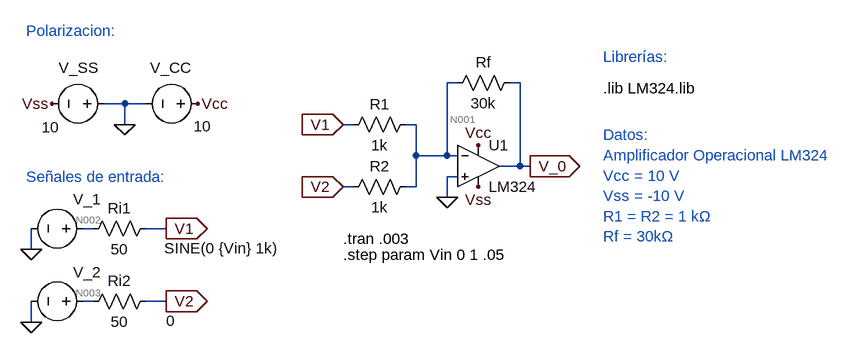
[diagram p0: schematic Lab_2_Circ_1_saturacion.asc]
Lab_2_Circ_1_saturacion.asc, the LTspice schematic file:
Version 4
SHEET 1 1560 680
WIRE 544 -288 528 -288
WIRE 640 -288 624 -288
WIRE 32 -256 0 -256
WIRE 64 -256 32 -256
WIRE 32 -224 32 -256
WIRE 384 -224 368 -224
WIRE 480 -224 464 -224
WIRE 480 -176 480 -224
WIRE 528 -176 528 -288
WIRE 528 -176 480 -176
WIRE 544 -176 528 -176
WIRE 640 -160 640 -288
WIRE 640 -160 608 -160
WIRE 656 -160 640 -160
WIRE 544 -144 528 -144
WIRE 384 -128 368 -128
WIRE 480 -128 480 -176
WIRE 480 -128 464 -128
WIRE 528 -112 528 -144
WIRE -16 -64 -32 -64
WIRE 96 -64 64 -64
WIRE -112 -32 -112 -64
WIRE -16 48 -32 48
WIRE 96 48 64 48
WIRE -112 80 -112 48
FLAG 528 -112 0
FLAG 144 -256 Vcc
FLAG 576 -192 Vcc
FLAG -80 -256 Vss
FLAG 576 -128 Vss
FLAG 32 -224 0
FLAG -112 -32 0
FLAG 368 -224 V1
IOPIN 368 -224 In
FLAG 96 -64 V1
IOPIN 96 -64 Out
FLAG 368 -128 V2
IOPIN 368 -128 In
FLAG 656 -160 V_0
IOPIN 656 -160 Out
FLAG -112 80 0
FLAG 96 48 V2
IOPIN 96 48 Out
SYMBOL OpAmps\\opamp2 576 -224 R0
SYMATTR InstName U1
SYMATTR Value LM324
SYMBOL res 368 -208 R270
WINDOW 0 32 56 VTop 2
WINDOW 3 0 56 VBottom 2
SYMATTR InstName R1
SYMATTR Value 1k
SYMBOL res 368 -112 R270
WINDOW 0 32 56 VTop 2
WINDOW 3 0 56 VBottom 2
SYMATTR InstName R2
SYMATTR Value 1k
SYMBOL res 640 -304 R90
WINDOW 0 0 56 VBottom 2
WINDOW 3 32 56 VTop 2
SYMATTR InstName Rf
SYMATTR Value 30k
SYMBOL res -32 -48 R270
WINDOW 0 32 56 VTop 2
WINDOW 3 0 56 VBottom 2
SYMATTR InstName Ri1
SYMATTR Value 50
SYMBOL voltage -16 -64 M270
WINDOW 0 45 31 VLeft 2
WINDOW 3 -30 -109 VLeft 2
WINDOW 123 -27 -57 VLeft 2
WINDOW 39 0 0 Left 0
SYMATTR InstName V_1
SYMATTR Value SINE(0 {Vin} 1k)
SYMBOL voltage 160 -256 R90
WINDOW 0 -55 25 VRight 2
WINDOW 3 35 -5 VRight 2
WINDOW 123 0 0 Left 0
WINDOW 39 0 0 Left 0
SYMATTR InstName V_CC
SYMATTR Value 10
SYMBOL voltage 16 -256 R90
WINDOW 0 -55 25 VRight 2
WINDOW 3 36 85 VRight 2
WINDOW 123 0 0 Left 0
WINDOW 39 0 0 Left 0
SYMATTR InstName V_SS
SYMATTR Value 10
SYMBOL res -32 64 R270
WINDOW 0 32 56 VTop 2
WINDOW 3 0 56 VBottom 2
SYMATTR InstName Ri2
SYMATTR Value 50
SYMBOL voltage -16 48 M270
WINDOW 0 45 31 VLeft 2
WINDOW 3 -30 -112 VLeft 2
WINDOW 123 0 0 Left 0
WINDOW 39 0 0 Left 0
SYMATTR InstName V_2
SYMATTR Value 0
TEXT 768 -280 Left 2 !.lib LM324.lib
TEXT 768 -328 Left 2 ;Librerías:
TEXT -120 -368 Left 2 ;Polarizacion:
TEXT -120 -144 Left 2 ;Señales de entrada:
TEXT 768 -208 Left 2 ;Datos:\nAmplificador Operacional LM324\nVcc = 10 V\nVss = -10 V\nR1 = R2 = 1 kΩ\nRf = 30kΩ
TEXT 368 -48 Left 2 !.tran .003
TEXT 368 -24 Left 2 !.step param Vin 0 1 .05

The netlist it stands for:
* Lab_2_Circ_1_saturacion.asc
XU1 0 N001 Vcc Vss V_0 LM324  ; pins In+ In- V+ V- OUT
R1 V1 N001 1k
R2 V2 N001 1k
Rf V_0 N001 30k
Ri1 N002 V1 50
V_1 N002 0 SINE(0 {Vin} 1k)
V_CC Vcc 0 10
V_SS 0 Vss 10
Ri2 N003 V2 50
V_2 N003 0 0
.lib LM324.lib
* Librerías:
* Polarizacion:
* Señales de entrada:
* Datos:
* Amplificador Operacional LM324
* Vcc = 10 V
* Vss = -10 V
* R1 = R2 = 1 kΩ
* Rf = 30kΩ
.tran .003
.step param Vin 0 1 .05
.backanno
.end

* Results of the author's LTspice run, read from the files saved beside the schematic
* Operating Point (first step), zero values left out:
*   V(v_0) = -2.554 mV
*   V(vss) = -10 V
*   V(vcc) = 10 V
*   V(n001) = -33.63 µV
*   V(n002) = -1.601 µV
*   V(n003) = -1.601 µV
*   I(Ri2) = 32.03 nA
*   I(Ri1) = 32.03 nA
*   I(Rf) = -84 nA
*   I(R2) = 32.03 nA
*   I(R1) = 32.03 nA
*   I(V_2) = -32.03 nA
*   I(V_ss) = -669.8 µA
*   I(V_cc) = -669.9 µA
*   I(V_1) = -32.03 nA
*   Ix(u1:1) = -19.92 nA
*   Ix(u1:2) = -19.94 nA
*   Ix(u1:3) = 669.9 µA
*   Ix(u1:4) = -669.8 µA
*   Ix(u1:5) = 84 nA
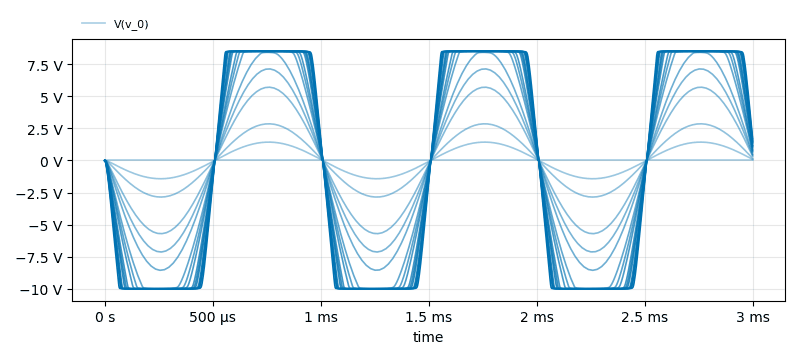
[diagram p1: Transient Analysis of Lab_2_Circ_1_saturacion.asc, plotted from the saved traces]
* Transient Analysis, 21 runs:
*   V(v_0) [run 1]: min -2.554 mV, max -2.554 mV, average -2.554 mV, rms 2.554 mV, last -2.554 mV
*   V(v_0) [run 2]: min -1.428 V, max 1.422 V, average -2.813 mV, rms 1.008 V, last 80.44 mV
*   V(v_0) [run 3]: min -2.853 V, max 2.847 V, average -3.074 mV, rms 2.015 V, last 163.5 mV
*   V(v_0) [run 4]: min -5.701 V, max 5.696 V, average -3.599 mV, rms 4.031 V, last 329.7 mV
*   V(v_0) [run 5]: min -7.128 V, max 7.119 V, average -3.867 mV, rms 5.038 V, last 413.1 mV
*   V(v_0) [run 6]: min -8.554 V, max 8.407 V, average -9.671 mV, rms 6.038 V, last 496.6 mV
*   V(v_0) [run 7]: min -9.965 V, max 8.481 V, average -299.9 mV, rms 7.28 V, last 664.3 mV
*   V(v_0) [run 8]: min -9.981 V, max 8.489 V, average -367.9 mV, rms 7.574 V, last 748.5 mV